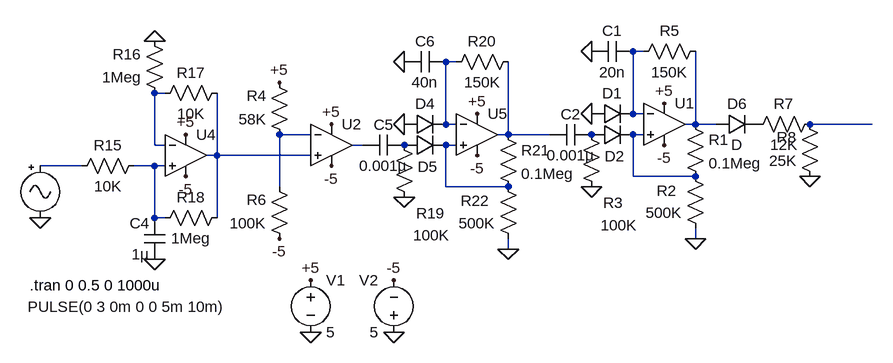
[diagram p0: schematic Leak-5.asc]
Leak-5.asc, the LTspice schematic file:
Version 4
SHEET 1 2784 1552
WIRE 528 -336 512 -336
WIRE 240 -320 224 -320
WIRE -208 -272 -224 -272
WIRE 512 -240 512 -336
WIRE 528 -240 512 -240
WIRE 224 -224 224 -320
WIRE 240 -224 224 -224
WIRE 608 -224 608 -336
WIRE 608 -224 592 -224
WIRE 640 -224 608 -224
WIRE 880 -224 784 -224
WIRE 16 -208 -32 -208
WIRE 320 -208 320 -320
WIRE 320 -208 304 -208
WIRE 384 -208 320 -208
WIRE 528 -208 512 -208
WIRE -224 -192 -224 -272
WIRE -208 -192 -224 -192
WIRE 96 -192 80 -192
WIRE 240 -192 224 -192
WIRE -128 -176 -128 -272
WIRE -128 -176 -144 -176
WIRE 16 -176 -128 -176
WIRE -336 -160 -400 -160
WIRE -224 -160 -256 -160
WIRE -208 -160 -224 -160
WIRE 512 -144 512 -208
WIRE 608 -144 512 -144
WIRE -32 -128 -32 -208
WIRE 224 -128 224 -192
WIRE 320 -128 224 -128
WIRE -224 -80 -224 -160
WIRE -208 -80 -224 -80
WIRE -128 -80 -128 -176
WIRE 608 -48 608 -64
WIRE 320 -32 320 -48
FLAG -400 -80 0
FLAG 272 -240 +5
FLAG 272 -176 -5
FLAG 160 -224 0
FLAG 160 -320 0
FLAG 160 -112 0
FLAG 320 -32 0
FLAG -176 -208 +5
FLAG -176 -144 -5
FLAG -224 -16 0
FLAG -224 -352 0
FLAG 16 96 0
FLAG 144 96 0
FLAG 144 16 -5
FLAG 16 16 +5
FLAG 48 -224 +5
FLAG 48 -160 -5
FLAG -32 -48 -5
FLAG -32 -288 +5
FLAG 560 -256 +5
FLAG 560 -192 -5
FLAG 448 -240 0
FLAG 448 -336 0
FLAG 448 -128 0
FLAG 608 -48 0
FLAG 784 -144 0
SYMBOL res -240 -176 R90
WINDOW 0 0 56 VBottom 2
WINDOW 3 32 56 VTop 2
SYMATTR InstName R15
SYMATTR Value 10K
SYMBOL Opamps\\UniversalOpamp2 272 -208 R0
SYMATTR InstName U5
SYMBOL diode 160 -208 R270
WINDOW 0 32 32 VTop 2
WINDOW 3 0 32 Invisible 2
SYMATTR InstName D4
SYMBOL diode 160 -176 R270
WINDOW 0 -33 36 VTop 2
WINDOW 3 0 32 Invisible 2
SYMATTR InstName D5
SYMBOL res 304 -224 R0
SYMATTR InstName R21
SYMATTR Value 0.1Meg
SYMBOL res 336 -32 R180
WINDOW 0 45 74 Left 2
WINDOW 3 36 40 Left 2
SYMATTR InstName R22
SYMATTR Value 500K
SYMBOL res 144 -208 R0
WINDOW 0 34 121 Left 2
WINDOW 3 30 155 Left 2
SYMATTR InstName R19
SYMATTR Value 100K
SYMBOL res 336 -336 R90
WINDOW 0 0 56 VBottom 2
WINDOW 3 32 56 VTop 2
SYMATTR InstName R20
SYMATTR Value 150K
SYMBOL cap 224 -336 R90
WINDOW 0 0 32 VBottom 2
WINDOW 3 32 32 VTop 2
SYMATTR InstName C6
SYMATTR Value 40n
SYMBOL cap 160 -208 R90
WINDOW 0 0 32 VBottom 2
WINDOW 3 32 32 VTop 2
SYMATTR InstName C5
SYMATTR Value 0.001µ
SYMBOL Opamps\\UniversalOpamp2 -176 -176 R0
SYMATTR InstName U4
SYMBOL cap -208 -16 R180
WINDOW 0 24 56 Left 2
WINDOW 3 24 8 Left 2
SYMATTR InstName C4
SYMATTR Value 1µ
SYMBOL res -112 -288 R90
WINDOW 0 0 56 VBottom 2
WINDOW 3 32 56 VTop 2
SYMATTR InstName R17
SYMATTR Value 10K
SYMBOL res -112 -96 R90
WINDOW 0 0 56 VBottom 2
WINDOW 3 32 56 VTop 2
SYMATTR InstName R18
SYMATTR Value 1Meg
SYMBOL res -208 -256 R180
WINDOW 0 36 76 Left 2
WINDOW 3 36 40 Left 2
SYMATTR InstName R16
SYMATTR Value 1Meg
SYMBOL voltage 16 0 R0
WINDOW 123 0 0 Left 2
WINDOW 39 0 0 Left 2
SYMATTR InstName V1
SYMATTR Value 5
SYMBOL voltage 144 112 R180
WINDOW 0 24 96 Left 2
WINDOW 3 24 16 Left 2
WINDOW 123 0 0 Left 2
WINDOW 39 0 0 Left 2
SYMATTR InstName V2
SYMATTR Value 5
SYMBOL Misc\\signal -400 -176 R0
WINDOW 0 24 16 Invisible 2
WINDOW 3 -19 233 Left 2
WINDOW 123 0 0 Left 2
WINDOW 39 0 0 Left 2
SYMATTR InstName V3
SYMATTR Value PULSE(0 3 0m 0 0 5m 10m)
SYMBOL Opamps\\UniversalOpamp2 48 -192 R0
SYMATTR InstName U2
SYMBOL res -16 -192 R180
WINDOW 0 36 76 Left 2
WINDOW 3 36 40 Left 2
SYMATTR InstName R4
SYMATTR Value 58K
SYMBOL res -16 -32 R180
WINDOW 0 36 76 Left 2
WINDOW 3 36 40 Left 2
SYMATTR InstName R6
SYMATTR Value 100K
SYMBOL Opamps\\UniversalOpamp2 560 -224 R0
SYMATTR InstName U1
SYMBOL diode 448 -224 R270
WINDOW 0 32 32 VTop 2
WINDOW 3 0 32 Invisible 2
SYMATTR InstName D1
SYMBOL diode 448 -192 R270
WINDOW 0 -33 36 VTop 2
WINDOW 3 0 32 Invisible 2
SYMATTR InstName D2
SYMBOL res 592 -240 R0
SYMATTR InstName R1
SYMATTR Value 0.1Meg
SYMBOL res 624 -48 R180
WINDOW 0 45 74 Left 2
WINDOW 3 36 40 Left 2
SYMATTR InstName R2
SYMATTR Value 500K
SYMBOL res 432 -224 R0
WINDOW 0 34 121 Left 2
WINDOW 3 30 155 Left 2
SYMATTR InstName R3
SYMATTR Value 100K
SYMBOL res 624 -352 R90
WINDOW 0 0 56 VBottom 2
WINDOW 3 32 56 VTop 2
SYMATTR InstName R5
SYMATTR Value 150K
SYMBOL cap 512 -352 R90
WINDOW 0 0 32 VBottom 2
WINDOW 3 32 32 VTop 2
SYMATTR InstName C1
SYMATTR Value 20n
SYMBOL cap 448 -224 R90
WINDOW 0 0 32 VBottom 2
WINDOW 3 32 32 VTop 2
SYMATTR InstName C2
SYMATTR Value 0.001µ
SYMBOL diode 640 -208 R270
WINDOW 0 32 32 VTop 2
WINDOW 3 0 32 VBottom 2
SYMATTR InstName D6
SYMBOL res 800 -240 R90
WINDOW 0 0 56 VBottom 2
WINDOW 3 32 56 VTop 2
SYMATTR InstName R7
SYMATTR Value 12K
SYMBOL res 800 -128 R180
WINDOW 0 36 76 Left 2
WINDOW 3 36 40 Left 2
SYMATTR InstName R8
SYMATTR Value 25K
TEXT -416 24 Left 2 !.tran 0 0.5 0 1000u

The netlist it stands for:
* Leak-5.asc
R15 N013 N012 10K
XU5 N010 N002 +5 -5 N007 level.2 Avol=1Meg GBW=10Meg Slew=10Meg ilimit=25m rail=0 Vos=0 phimargin=45 en=0 enk=0 in=0 ink=0 Rin=500Meg  ; pins IN+ IN- V+ V- OUT
D4 0 N002 D
D5 P001 N010 D
R21 N007 N010 0.1Meg
R22 0 N010 500K
R19 P001 0 100K
R20 N007 N002 150K
C6 N002 0 40n
C5 P001 N009 0.001µ
XU4 N013 N003 +5 -5 N011 level.2 Avol=1Meg GBW=10Meg Slew=10Meg ilimit=25m rail=0 Vos=0 phimargin=45 en=0 enk=0 in=0 ink=0 Rin=500Meg  ; pins IN+ IN- V+ V- OUT
C4 0 N013 1µ
R17 N011 N003 10K
R18 N011 N013 1Meg
R16 N003 0 1Meg
V1 +5 0 5
V2 0 -5 5
V3 N012 0 PULSE(0 3 0m 0 0 5m 10m)
XU2 N011 N006 +5 -5 N009 level.2 Avol=1Meg GBW=10Meg Slew=10Meg ilimit=25m rail=0 Vos=0 phimargin=45 en=0 enk=0 in=0 ink=0 Rin=500Meg  ; pins IN+ IN- V+ V- OUT
R4 N006 +5 58K
R6 -5 N006 100K
XU1 N008 N001 +5 -5 N004 level.2 Avol=1Meg GBW=10Meg Slew=10Meg ilimit=25m rail=0 Vos=0 phimargin=45 en=0 enk=0 in=0 ink=0 Rin=500Meg  ; pins IN+ IN- V+ V- OUT
D1 0 N001 D
D2 P002 N008 D
R1 N004 N008 0.1Meg
R2 0 N008 500K
R3 P002 0 100K
R5 N004 N001 150K
C1 N001 0 20n
C2 P002 N007 0.001µ
D6 N004 P003 D
R7 N005 P003 12K
R8 0 N005 25K
.model D D
.lib standard.dio
.tran 0 0.5 0 1000u
.lib UniversalOpamps2.sub
.backanno
.end